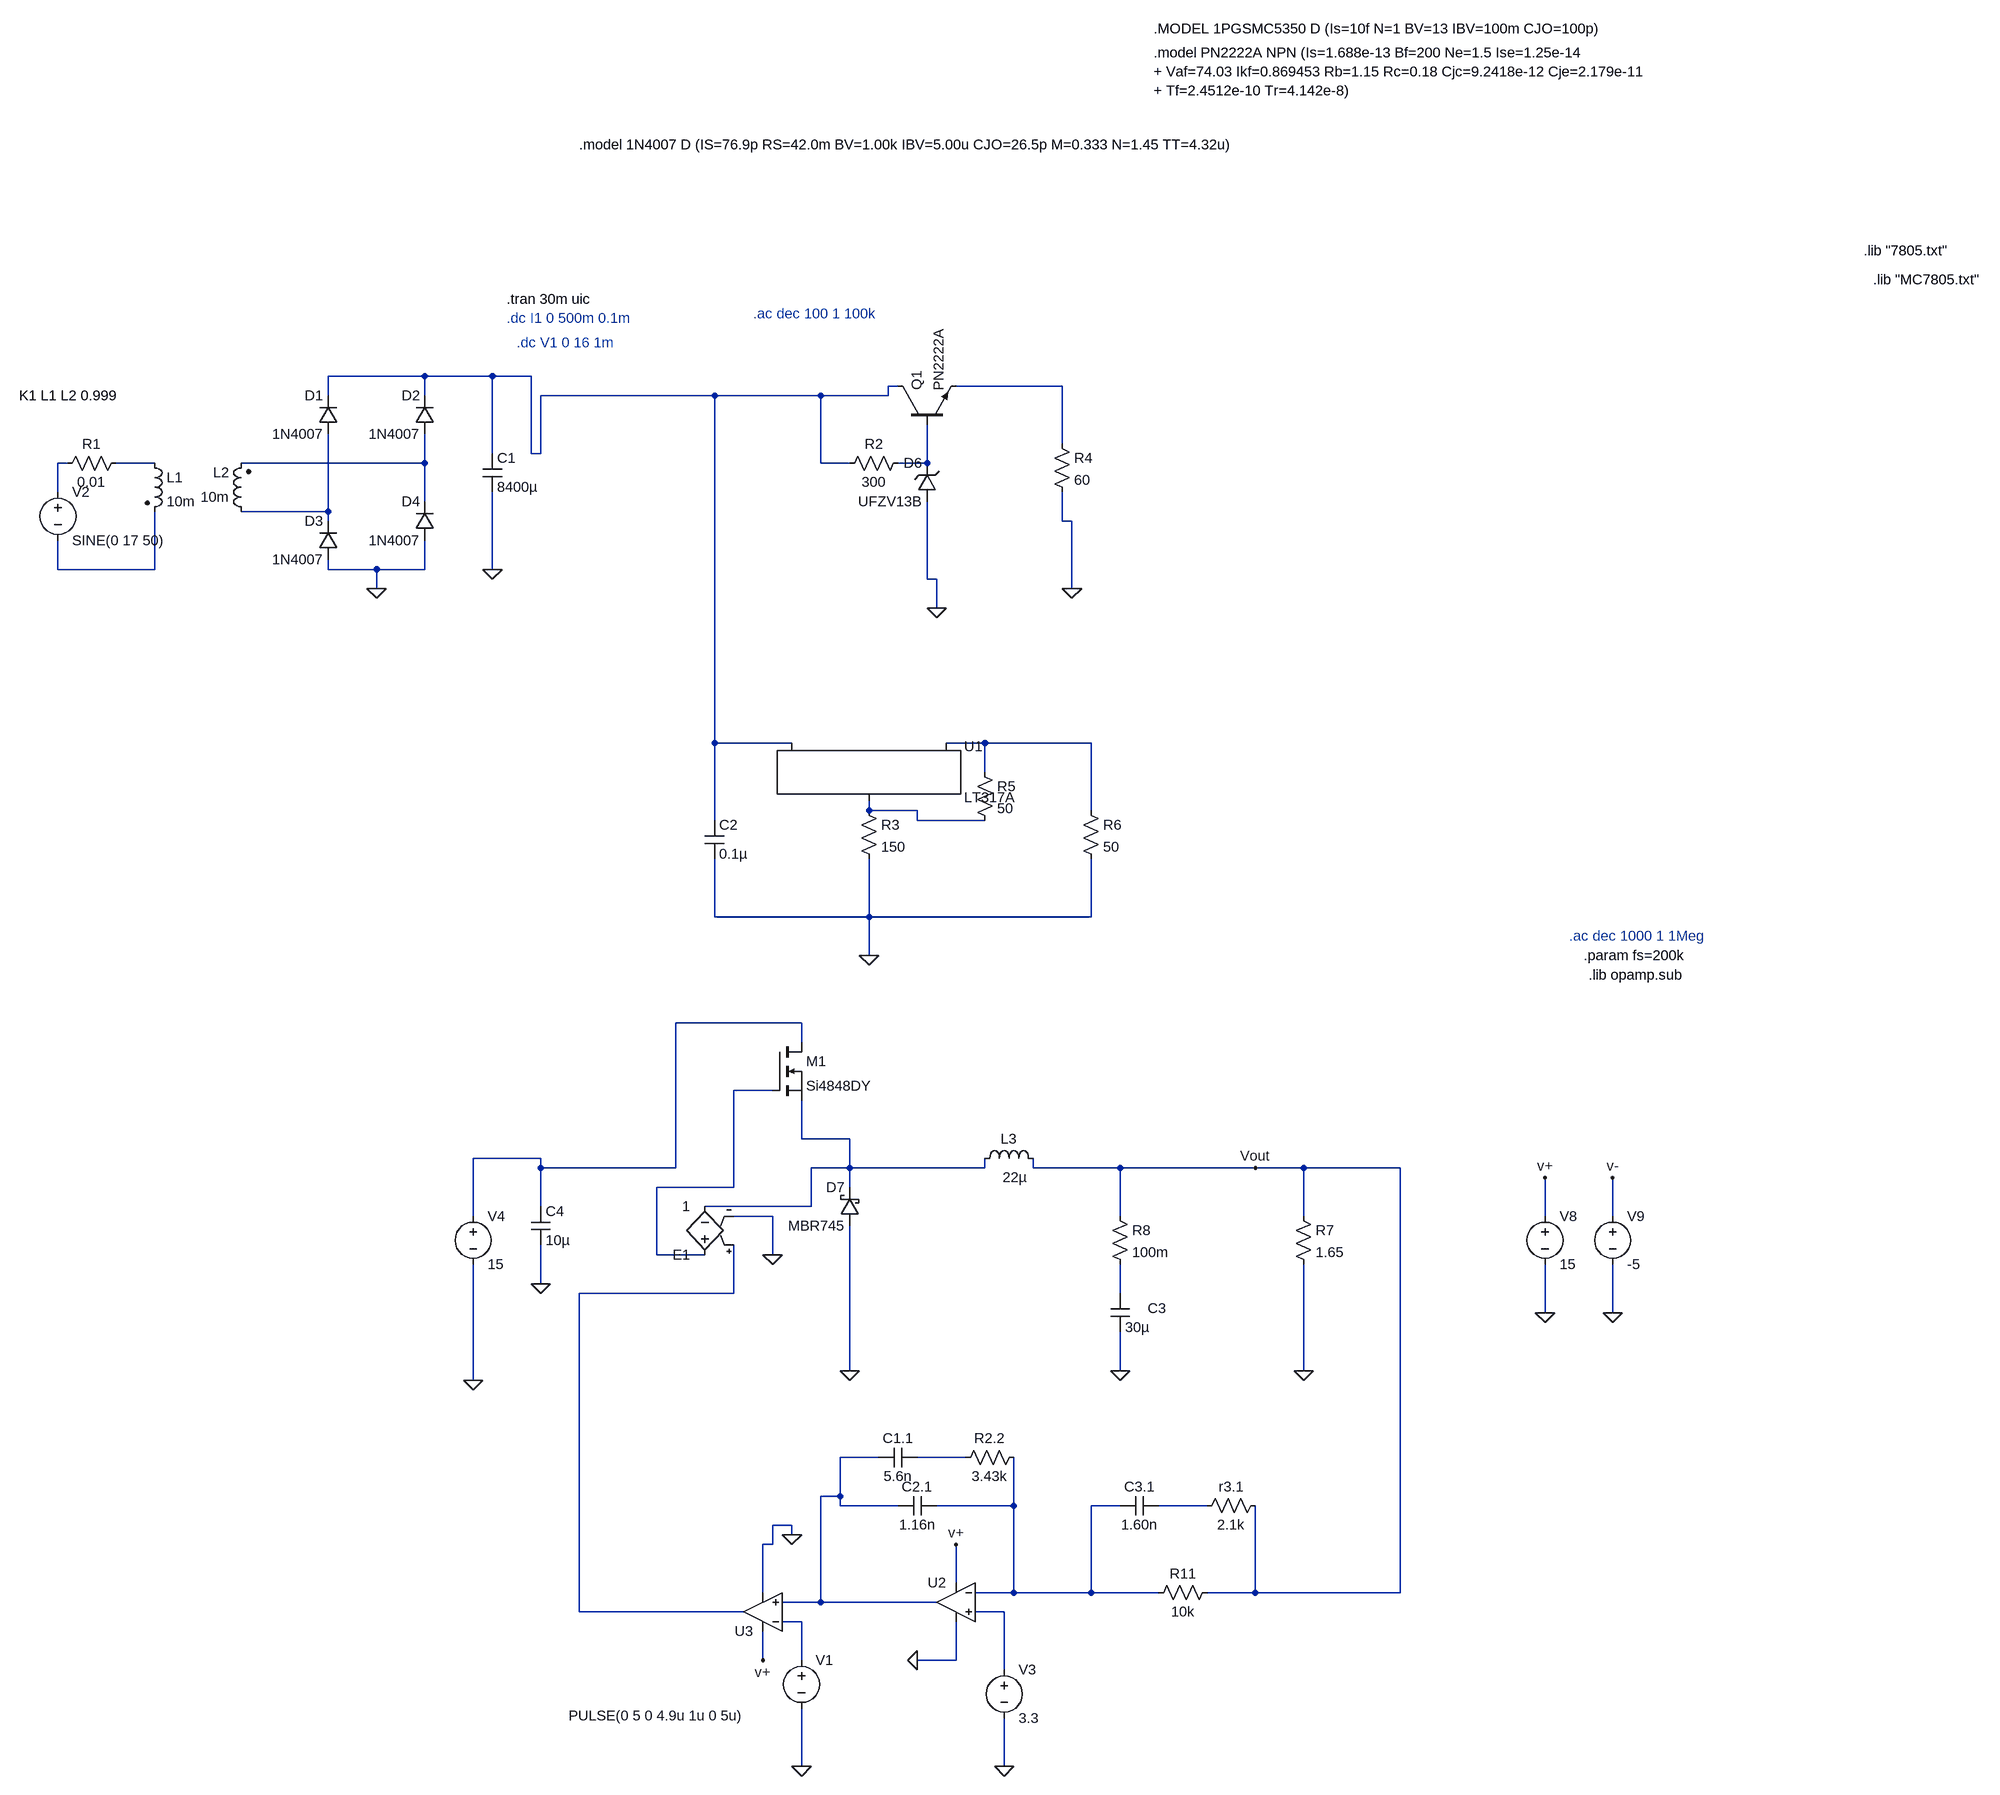
[diagram p0: schematic Proiect surse.asc]
Proiect surse.asc, the LTspice schematic file:
Version 4
SHEET 1 5156 2336
WIRE 480 -16 320 -16
WIRE 592 -16 480 -16
WIRE 656 -16 592 -16
WIRE 1264 0 1248 0
WIRE 1536 0 1360 0
WIRE 320 16 320 -16
WIRE 480 16 480 -16
WIRE 960 16 672 16
WIRE 1136 16 960 16
WIRE 1248 16 1248 0
WIRE 1248 16 1136 16
WIRE 1536 96 1536 0
WIRE 592 112 592 -16
WIRE 656 112 656 -16
WIRE 672 112 672 16
WIRE 672 112 656 112
WIRE -112 128 -128 128
WIRE 32 128 -32 128
WIRE 480 128 480 80
WIRE 480 128 176 128
WIRE 1136 128 1136 16
WIRE 1184 128 1136 128
WIRE 1312 128 1312 64
WIRE 1312 128 1264 128
WIRE -128 176 -128 128
WIRE 480 192 480 128
WIRE 320 208 320 80
WIRE 320 208 176 208
WIRE 320 224 320 208
WIRE 1536 224 1536 176
WIRE 1552 224 1536 224
WIRE -128 304 -128 256
WIRE 32 304 32 208
WIRE 32 304 -128 304
WIRE 320 304 320 288
WIRE 400 304 320 304
WIRE 480 304 480 256
WIRE 480 304 400 304
WIRE 592 304 592 176
WIRE 1312 320 1312 192
WIRE 1328 320 1312 320
WIRE 400 336 400 304
WIRE 1552 336 1552 224
WIRE 1328 368 1328 320
WIRE 960 592 960 16
WIRE 1088 592 960 592
WIRE 1408 592 1344 592
WIRE 1584 592 1408 592
WIRE 1408 640 1408 592
WIRE 1216 704 1216 688
WIRE 1296 704 1216 704
WIRE 1584 704 1584 592
WIRE 960 720 960 592
WIRE 1296 720 1296 704
WIRE 1408 720 1296 720
WIRE 960 880 960 784
WIRE 1216 880 1216 784
WIRE 1216 880 960 880
WIRE 1584 880 1584 784
WIRE 1584 880 1216 880
WIRE 1216 944 1216 880
WIRE 1104 1056 896 1056
WIRE 1104 1088 1104 1056
WIRE 1056 1168 992 1168
WIRE 1104 1248 1104 1184
WIRE 1184 1248 1104 1248
WIRE 672 1280 560 1280
WIRE 672 1296 672 1280
WIRE 896 1296 896 1056
WIRE 896 1296 672 1296
WIRE 1184 1296 1184 1248
WIRE 1184 1296 1120 1296
WIRE 1408 1296 1408 1280
WIRE 1408 1296 1184 1296
WIRE 1488 1296 1488 1280
WIRE 1632 1296 1488 1296
WIRE 1856 1296 1632 1296
WIRE 1936 1296 1856 1296
WIRE 2096 1296 1936 1296
WIRE 992 1328 992 1168
WIRE 992 1328 864 1328
WIRE 1184 1328 1184 1296
WIRE 672 1360 672 1296
WIRE 1120 1360 1120 1296
WIRE 1120 1360 944 1360
WIRE 560 1376 560 1280
WIRE 1056 1376 992 1376
WIRE 1632 1376 1632 1296
WIRE 1936 1376 1936 1296
WIRE 2336 1376 2336 1312
WIRE 2448 1376 2448 1312
WIRE 864 1440 864 1328
WIRE 944 1440 864 1440
WIRE 1056 1440 1056 1376
WIRE 672 1488 672 1424
WIRE 992 1504 992 1424
WIRE 992 1504 736 1504
WIRE 1632 1504 1632 1456
WIRE 2336 1536 2336 1456
WIRE 2448 1536 2448 1456
WIRE 1184 1632 1184 1392
WIRE 1632 1632 1632 1568
WIRE 1936 1632 1936 1456
WIRE 560 1648 560 1456
WIRE 1232 1776 1168 1776
WIRE 1376 1776 1296 1776
WIRE 1168 1840 1168 1776
WIRE 1168 1840 1136 1840
WIRE 1168 1856 1168 1840
WIRE 1264 1856 1168 1856
WIRE 1456 1856 1456 1776
WIRE 1456 1856 1328 1856
WIRE 1632 1856 1584 1856
WIRE 1776 1856 1696 1856
WIRE 1088 1888 1056 1888
WIRE 1088 1904 1088 1888
WIRE 1056 1920 1056 1888
WIRE 1056 1920 1040 1920
WIRE 1360 1984 1360 1920
WIRE 1040 2000 1040 1920
WIRE 1456 2000 1456 1856
WIRE 1456 2000 1392 2000
WIRE 1584 2000 1584 1856
WIRE 1584 2000 1456 2000
WIRE 1696 2000 1584 2000
WIRE 1856 2000 1856 1856
WIRE 1856 2000 1776 2000
WIRE 2096 2000 2096 1296
WIRE 2096 2000 1856 2000
WIRE 1136 2016 1136 1840
WIRE 1136 2016 1072 2016
WIRE 1328 2016 1136 2016
WIRE 736 2032 736 1504
WIRE 1008 2032 736 2032
WIRE 1440 2032 1392 2032
WIRE 1104 2048 1072 2048
WIRE 1040 2112 1040 2064
WIRE 1104 2112 1104 2048
WIRE 1360 2112 1360 2048
WIRE 1360 2112 1296 2112
WIRE 1440 2128 1440 2032
WIRE 1104 2288 1104 2192
WIRE 1440 2288 1440 2208
FLAG 400 336 0
FLAG 1328 368 0
FLAG 592 304 0
FLAG 1552 336 0
FLAG 1216 944 0
FLAG 1184 1632 0
FLAG 1632 1632 0
FLAG 1936 1632 0
FLAG 1856 1296 Vout
FLAG 1440 2288 0
FLAG 1104 2288 0
FLAG 2448 1536 0
FLAG 2336 1536 0
FLAG 2336 1312 v+
FLAG 2448 1312 v-
FLAG 1056 1440 0
FLAG 672 1488 0
FLAG 1040 2112 v+
FLAG 1360 1920 v+
FLAG 1088 1904 0
FLAG 1296 2112 0
FLAG 560 1648 0
SYMBOL diode 336 80 R180
WINDOW 0 24 64 Left 2
WINDOW 3 24 0 Left 2
SYMATTR InstName D1
SYMATTR Value 1N4007
SYMBOL diode 496 80 R180
WINDOW 0 24 64 Left 2
WINDOW 3 24 0 Left 2
SYMATTR InstName D2
SYMATTR Value 1N4007
SYMBOL diode 336 288 R180
WINDOW 0 24 64 Left 2
WINDOW 3 24 0 Left 2
SYMATTR InstName D3
SYMATTR Value 1N4007
SYMBOL diode 496 256 R180
WINDOW 0 24 64 Left 2
WINDOW 3 24 0 Left 2
SYMATTR InstName D4
SYMATTR Value 1N4007
SYMBOL cap 576 112 R0
SYMATTR InstName C1
SYMATTR Value 8400µ
SYMBOL res 1280 112 R90
WINDOW 0 0 56 VBottom 2
WINDOW 3 32 56 VTop 2
SYMATTR InstName R2
SYMATTR Value 300
SYMBOL ind2 16 112 R0
SYMATTR InstName L1
SYMATTR Value 10m
SYMATTR Type ind
SYMBOL ind2 192 224 R180
WINDOW 0 36 80 Left 2
WINDOW 3 36 40 Left 2
SYMATTR InstName L2
SYMATTR Value 10m
SYMATTR Type ind
SYMBOL res -16 112 R90
WINDOW 0 0 56 VBottom 2
WINDOW 3 32 56 VTop 2
SYMATTR InstName R1
SYMATTR Value 0.01
SYMBOL voltage -128 160 R0
WINDOW 123 0 0 Left 0
WINDOW 39 0 0 Left 0
SYMATTR InstName V2
SYMATTR Value SINE(0 17 50)
SYMBOL npn 1264 64 R270
SYMATTR InstName Q1
SYMATTR Value PN2222A
SYMBOL zener 1328 192 R180
WINDOW 0 24 64 Left 2
WINDOW 3 24 0 Left 2
SYMATTR InstName D6
SYMATTR Value UFZV13B
SYMBOL res 1520 80 R0
SYMATTR InstName R4
SYMATTR Value 60
SYMBOL PowerProducts\\LT317A 1216 592 R0
SYMATTR InstName U1
SYMBOL cap 944 720 R0
SYMATTR InstName C2
SYMATTR Value 0.1µ
SYMBOL res 1200 688 R0
SYMATTR InstName R3
SYMATTR Value 150
SYMBOL res 1392 624 R0
SYMATTR InstName R5
SYMATTR Value 50
SYMBOL res 1568 688 R0
SYMATTR InstName R6
SYMATTR Value 50
SYMBOL ind 1392 1296 R270
WINDOW 0 32 56 VTop 2
WINDOW 3 0 66 VBottom 2
SYMATTR InstName L3
SYMATTR Value 22µ
SYMBOL cap 1616 1504 R0
WINDOW 0 62 25 Left 2
SYMATTR InstName C3
SYMATTR Value 30µ
SYMBOL res 1920 1360 R0
SYMATTR InstName R7
SYMATTR Value 1.65
SYMBOL nmos 1056 1088 R0
SYMATTR InstName M1
SYMATTR Value Si4848DY
SYMBOL schottky 1200 1392 R180
WINDOW 0 24 64 Left 2
WINDOW 3 24 0 Left 2
SYMATTR InstName D7
SYMATTR Value MBR745
SYMATTR Description Zener Diode
SYMATTR Type zener
SYMBOL res 1760 1872 R270
WINDOW 0 32 56 VTop 2
WINDOW 3 0 56 VBottom 2
SYMATTR InstName r3.1
SYMATTR Value 2.1k
SYMBOL cap 1696 1840 R90
WINDOW 0 0 32 VBottom 2
WINDOW 3 32 32 VTop 2
SYMATTR InstName C3.1
SYMATTR Value 1.60n
SYMBOL res 1792 1984 R90
WINDOW 0 0 56 VBottom 2
WINDOW 3 32 56 VTop 2
SYMATTR InstName R11
SYMATTR Value 10k
SYMBOL res 1472 1760 R90
WINDOW 0 0 56 VBottom 2
WINDOW 3 32 56 VTop 2
SYMATTR InstName R2.2
SYMATTR Value 3.43k
SYMBOL cap 1232 1792 R270
WINDOW 0 32 32 VTop 2
WINDOW 3 0 32 VBottom 2
SYMATTR InstName C1.1
SYMATTR Value 5.6n
SYMBOL cap 1264 1872 R270
WINDOW 0 32 32 VTop 2
WINDOW 3 0 32 VBottom 2
SYMATTR InstName C2.1
SYMATTR Value 1.16n
SYMBOL OpAmps\\UniversalOpAmp 1360 2016 M0
SYMATTR InstName U2
SYMBOL OpAmps\\UniversalOpAmp2 1040 2032 R180
SYMATTR InstName U3
SYMBOL voltage 1440 2112 R0
WINDOW 123 0 0 Left 0
WINDOW 39 0 0 Left 0
SYMATTR InstName V3
SYMATTR Value 3.3
SYMBOL voltage 2336 1360 R0
WINDOW 123 0 0 Left 0
WINDOW 39 0 0 Left 0
SYMATTR InstName V8
SYMATTR Value 15
SYMBOL voltage 2448 1360 R0
SYMATTR InstName V9
SYMATTR Value -5
SYMBOL e 944 1456 R180
SYMATTR InstName E1
SYMATTR Value 1
SYMBOL cap 656 1360 R0
SYMATTR InstName C4
SYMATTR Value 10µ
SYMBOL voltage 1104 2096 R0
WINDOW 3 -386 108 Left 2
WINDOW 123 0 0 Left 0
WINDOW 39 0 0 Left 0
SYMATTR Value PULSE(0 5 0 4.9u 1u 0 5u)
SYMATTR InstName V1
SYMBOL voltage 560 1360 R0
WINDOW 123 0 0 Left 0
WINDOW 39 0 0 Left 0
SYMATTR InstName V4
SYMATTR Value 15
SYMBOL res 1616 1360 R0
SYMATTR InstName R8
SYMATTR Value 100m
TEXT 736 -400 Left 2 !.model 1N4007 D (IS=76.9p RS=42.0m BV=1.00k IBV=5.00u CJO=26.5p M=0.333 N=1.45 TT=4.32u)
TEXT 616 -144 Left 2 !.tran 30m uic
TEXT -192 16 Left 2 !K1 L1 L2 0.999
TEXT 616 -112 Left 2 ;.dc I1 0 500m 0.1m
TEXT 1688 -552 Left 2 !.model PN2222A NPN (Is=1.688e-13 Bf=200 Ne=1.5 Ise=1.25e-14\n+ Vaf=74.03 Ikf=0.869453 Rb=1.15 Rc=0.18 Cjc=9.2418e-12 Cje=2.179e-11\n+ Tf=2.4512e-10 Tr=4.142e-8)
TEXT 632 -72 Left 2 ;.dc V1 0 16 1m
TEXT 1688 -592 Left 2 !.MODEL 1PGSMC5350 D (Is=10f N=1 BV=13 IBV=100m CJO=100p)
TEXT 2864 -224 Left 2 !.lib "7805.txt"
TEXT 2880 -176 Left 2 !.lib "MC7805.txt"
TEXT 2408 976 Left 2 !.lib opamp.sub
TEXT 1024 -120 Left 2 ;.ac dec 100 1 100k
TEXT 2400 944 Left 2 !.param fs=200k
TEXT 2376 912 Left 2 ;.ac dec 1000 1 1Meg

The netlist it stands for:
* Proiect surse.asc
D1 N007 N001 1N4007
D2 N005 N001 1N4007
D3 0 N007 1N4007
D4 0 N005 1N4007
C1 N001 0 8400µ
R2 N006 N001 300
L1 N004 N008 10m
L2 N007 N005 10m
R1 N004 N003 0.01
V2 N003 N008 SINE(0 17 50)
Q1 N001 N006 N002 0 PN2222A
D6 0 N006 UFZV13B
R4 N002 0 60
XU1 N010 N009 N001 LT317A
C2 N001 0 0.1µ
R3 N010 0 150
R5 N009 N010 50
R6 N009 0 50
L3 N013 Vout 22µ
C3 N015 0 30µ
R7 Vout 0 1.65
M1 N011 N012 N013 N013 Si4848DY
D7 0 N013 MBR745
r3.1 N019 Vout 2.1k
C3.1 N019 N018 1.60n
R11 Vout N018 10k
R2.2 N018 N017 3.43k
C1.1 N016 N017 5.6n
C2.1 N016 N018 1.16n
XU2 N020 N018 v+ 0 N016 level1 Avol=1Meg GBW=10Meg Vos=0 En=0 Enk=0 In=0 Ink=0 Rin=500Meg  ; pins In+ In- V+ V- OUT
XU3 N016 N021 v+ 0 N014 level2 Avol=1Meg GBW=10Meg Slew=10Meg Ilimit=25m Rail=0 Vos=0 En=0 Enk=0 In=0 Ink=0 Rin=500Meg  ; pins In+ In- V+ V- OUT
V3 N020 0 3.3
V8 v+ 0 15
V9 v- 0 -5
E1 N012 N013 N014 0 1
C4 N011 0 10µ
V1 N021 0 PULSE(0 5 0 4.9u 1u 0 5u)
V4 N011 0 15
R8 Vout N015 100m
.model D D
.lib standard.dio
.model NPN NPN
.model PNP PNP
.lib standard.bjt
.model NMOS NMOS
.model PMOS PMOS
.lib standard.mos
.model 1N4007 D (IS=76.9p RS=42.0m BV=1.00k IBV=5.00u CJO=26.5p M=0.333 N=1.45 TT=4.32u)
.tran 30m uic
K1 L1 L2 0.999
* .dc I1 0 500m 0.1m
.model PN2222A NPN (Is=1.688e-13 Bf=200 Ne=1.5 Ise=1.25e-14
+ Vaf=74.03 Ikf=0.869453 Rb=1.15 Rc=0.18 Cjc=9.2418e-12 Cje=2.179e-11
+ Tf=2.4512e-10 Tr=4.142e-8)
* .dc V1 0 16 1m
.MODEL 1PGSMC5350 D (Is=10f N=1 BV=13 IBV=100m CJO=100p)
.lib "7805.txt"
.lib "MC7805.txt"
.lib opamp.sub
* .ac dec 100 1 100k
.param fs=200k
* .ac dec 1000 1 1Meg
.lib LTC.lib
.lib UniversalOpAmp1.lib
.lib UniversalOpAmp2.lib
.backanno
.end